# EAGLE schematic argon-v1.00 (EAGLE 9.0.1)

## Sheet 1 of 2
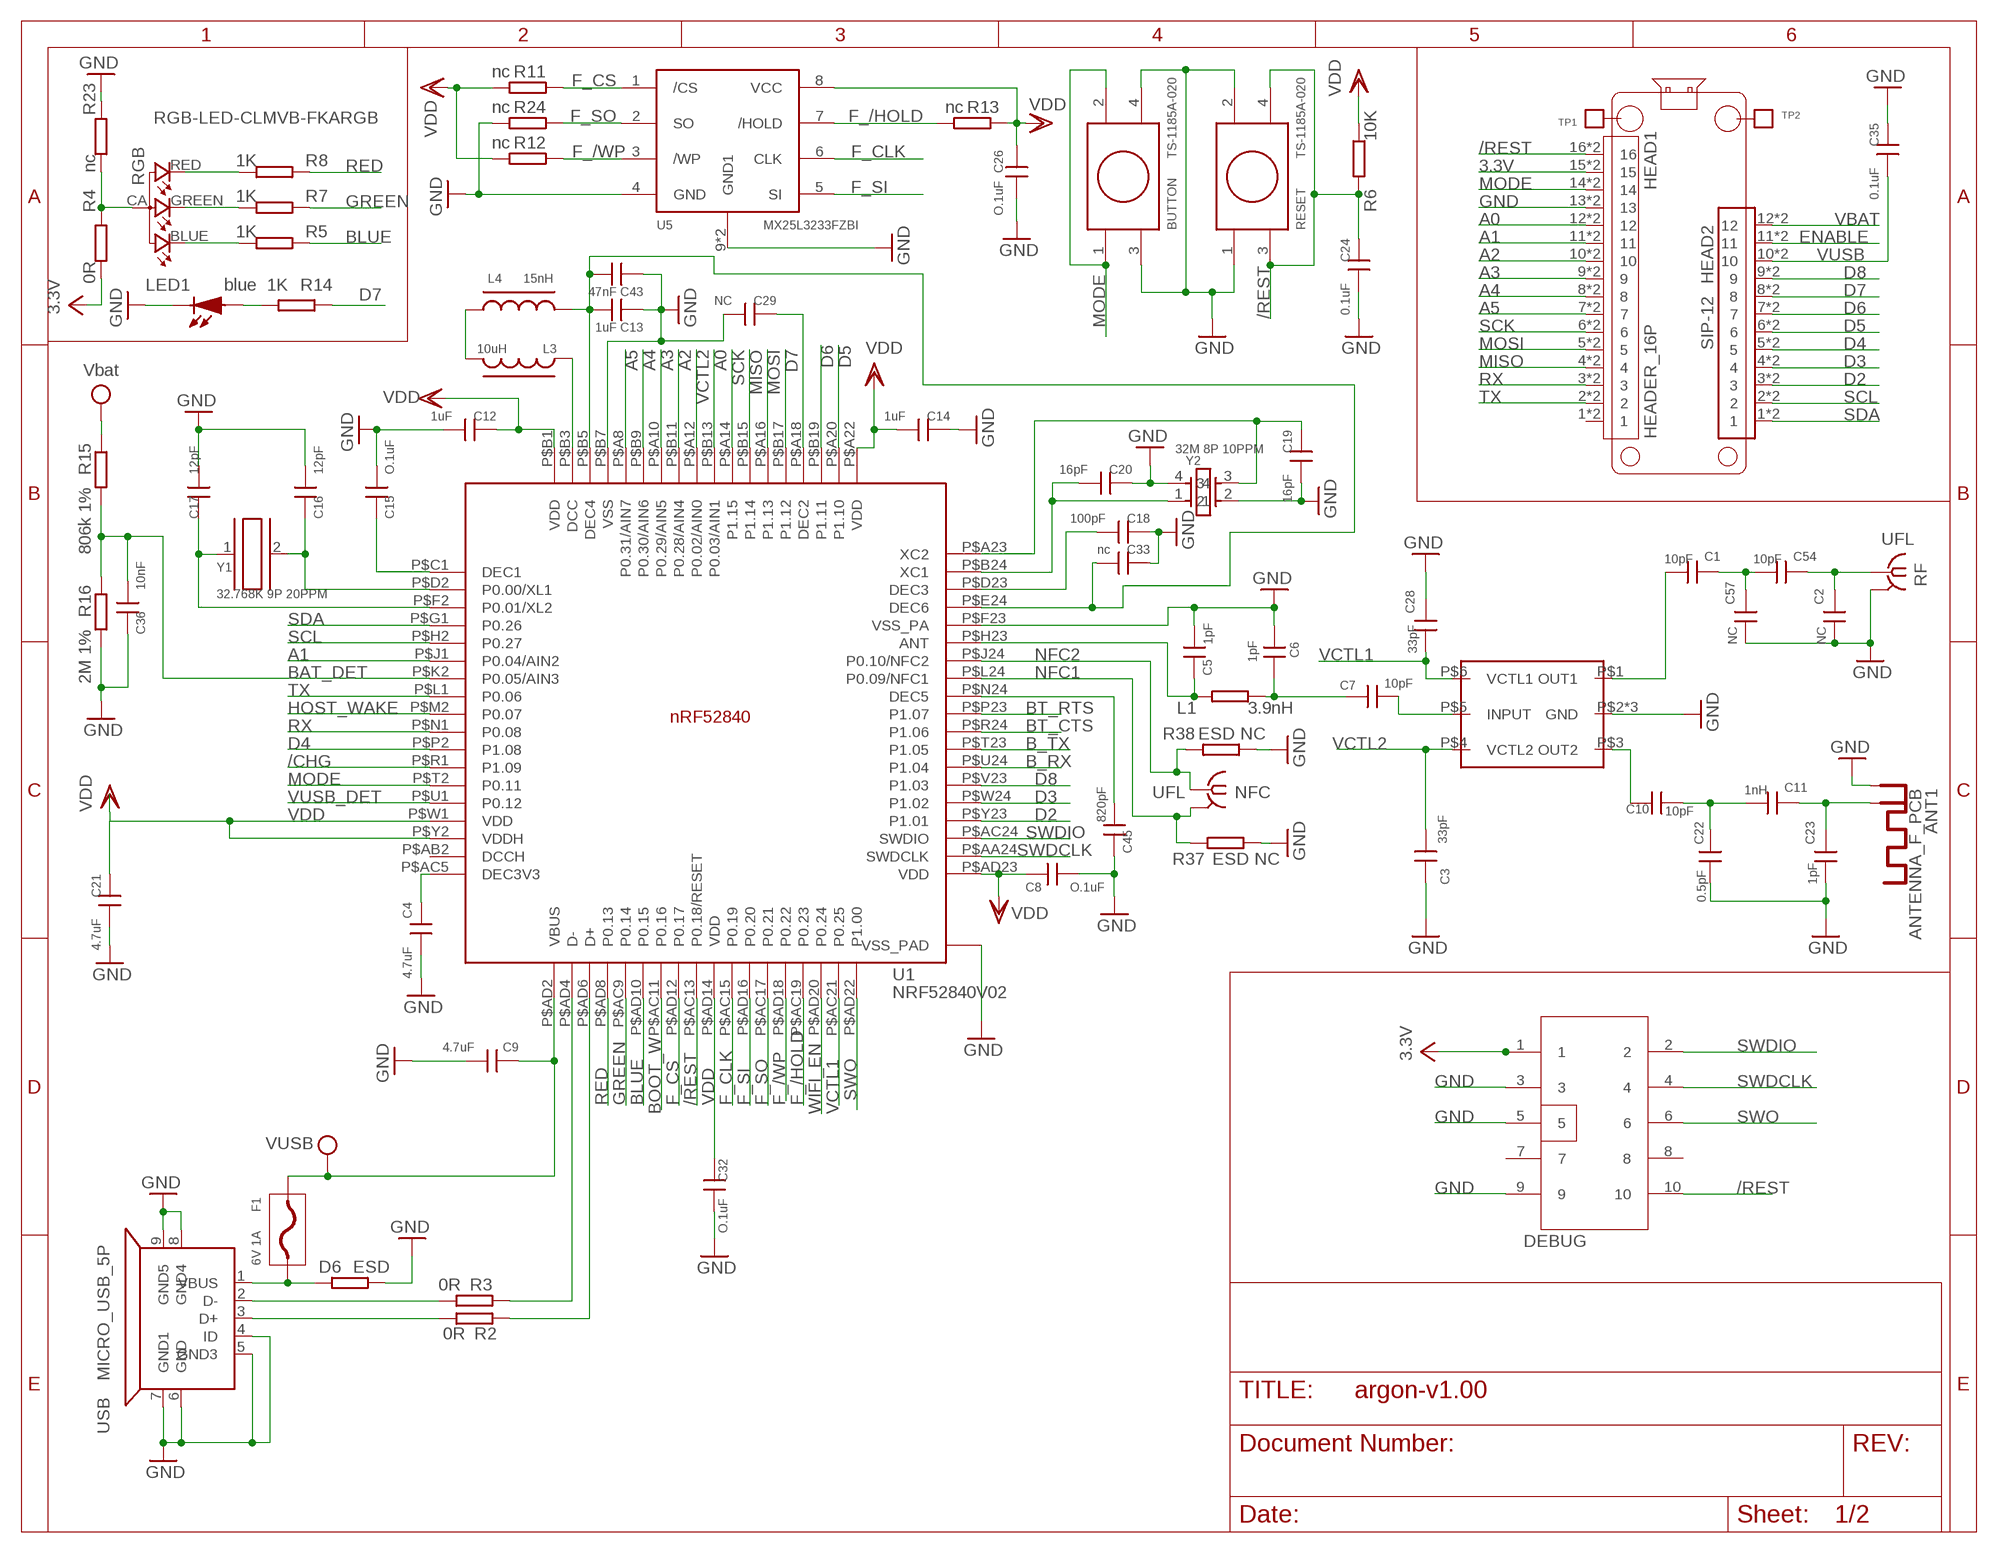
[diagram p0: schematic, sheet 1]

### Parts
ANT1  ANTENNA_F_PCB  [ANTENNA_F_PCB]
BUTTON  TS-1185A-020  [TS-1185A-020]
C1  10pF  CAP0402  [C-0402]
C2  NC  CAP0402  [C-0402]
C3  33pF  CAP0402  [C-0402]
C4  4.7uF  CAP0402  [C-0402]
C5  1pF  CAP0402  [C-0402]
C6  1pF  CAP0402  [C-0402]
C7  10pF  CAP0402  [C-0402]
C8  O.1uF  CAP0402  [C-0402]
C9  4.7uF  CAP0402  [C-0402]
C10  10pF  CAP0402  [C-0402]
C11  1nH  CAP0402  [C-0402]
C12  1uF  CAP0402  [C-0402]
C13  1uF  CAP0402  [C-0402]
C14  1uF  CAP0402  [C-0402]
C15  O.1uF  CAP0402  [C-0402]
C16  12pF  CAP0402  [C-0402]
C17  12pF  CAP0402  [C-0402]
C18  100pF  CAP0402  [C-0402]
C19  16pF  CAP0402  [C-0402]
C20  16pF  CAP0402  [C-0402]
C21  4.7uF  CAP0402  [C-0402]
C22  0.5pF  CAP0402  [C-0402]
C23  1pF  CAP0402  [C-0402]
C24  0.1uF  CAP0402  [C-0402]
C26  O.1uF  CAP0402  [C-0402]
C28  33pF  CAP0402  [C-0402]
C29  NC  CAP0402  [C-0402]
C32  O.1uF  CAP0402  [C-0402]
C33  nc  CAP0402  [C-0402]
C35  0.1uF  CAP0402  [C-0402]
C36  10nF  CAP0402  [C-0402]
C43  47nF  CAP0402  [C-0402]
C45  820pF  CAP0402  [C-0402]
C54  10pF  CAP0402  [C-0402]
C57  NC  CAP0402  [C-0402]
D6  ESD  RES0402S  [R-0402S]
DEBUG  CON5X2  [CON5X2_1.27]
F1  6V 1A  FUSE  [F0805]
HEAD1  HEADER_16P  [HEADER_16P2.54]
HEAD2  SIP-12  [SIP-12]
L1  3.9nH  RES0402S  [R-0402S]
L3  10uH  L  [R-0603A]
L4  15nH  L0402  [R-0402S]
LED1  blue  LED  [LED0603]
NFC  UFL  IPEX-20279-001E  [IPEX-20279-001E]
R2  0R  RES0402S  [R-0402S]
R3  0R  RES0402S  [R-0402S]
R4  0R  RES0402S  [R-0402S]
R5  1K  RES0402S  [R-0402S]
R6  10K  RES0402S  [R-0402S]
R7  1K  RES0402S  [R-0402S]
R8  1K  RES0402S  [R-0402S]
R11  nc  RES0402S  [R-0402S]
R12  nc  RES0402S  [R-0402S]
R13  nc  RES0402S  [R-0402S]
R14  1K  RES0402S  [R-0402S]
R15  806k 1%  RES0402S  [R-0402S]
R16  2M 1%  RES0402S  [R-0402S]
R23  nc  RES0402S  [R-0402S]
R24  nc  RES0402S  [R-0402S]
R37  ESD NC  RES0402S  [R-0402S]
R38  ESD NC  RES0402S  [R-0402S]
RESET  TS-1185A-020  [TS-1185A-020]
RF  UFL  IPEX-20279-001E  [IPEX-20279-001E]
RGB  RGB-LED-CLMVB-FKARGB  [PLCC4-2MM-RGB]
TP1  TPTP2.5  [TP-2.5]
TP2  TPTP2.5  [TP-2.5]
U1  NRF52840V02  [AQN507X7X0.85_HA-74_V2]
U5  MX25L3233FZBI  FLASH-SPIUSON-8L-4X3  [USON8-3X4]
U$2  SKY13351-378LF  [MLPD-6-1X1]
USB  MICRO_USB_5P  MICRO_USBMICRO_USB  [MICRO_USB]
Y1  32.768K 9P 20PPM  CRY_32153215  [CRY_3215]
Y2  32M 8P 10PPM  CRY2520  [CRY_2520]

### Nets
3.3V: DEBUG.1 HEAD1.15 HEAD1.P$15 R4.2 ; also sheet 2
/CHG: U1.P$R1(P1.09) ; also sheet 2
/REST: C24.2 DEBUG.10 HEAD1.16 HEAD1.P$16 R6.1 RESET.3 RESET.4 U1.P$AC13(P0.18/RESET) ; also sheet 2
A0: HEAD1.12 HEAD1.P$12 U1.P$B13(P0.03/AIN1)
A1: HEAD1.11 HEAD1.P$11 U1.P$J1(P0.04/AIN2)
A2: HEAD1.10 HEAD1.P$10 U1.P$B11(P0.28/AIN4)
A3: HEAD1.9 HEAD1.P$9 U1.P$A10(P0.29/AIN5)
A4: HEAD1.8 HEAD1.P$8 U1.P$B9(P0.30/AIN6)
A5: HEAD1.7 HEAD1.P$7 U1.P$A8(P0.31/AIN7)
B_RX: U1.P$U24(P1.04) ; also sheet 2
B_TX: U1.P$T23(P1.05) ; also sheet 2
BAT_DET: C36.1 R15.2 R16.1 U1.P$K2(P0.05/AIN3)
BLUE: R5.1 U1.P$AD10(P0.15)
BOOT_W: U1.P$AC11(P0.16) ; also sheet 2
BT_CTS: U1.P$R24(P1.06) ; also sheet 2
BT_RTS: U1.P$P23(P1.07) ; also sheet 2
D2: HEAD2.3 HEAD2.P$3 U1.P$Y23(P1.01)
D3: HEAD2.4 HEAD2.P$4 U1.P$W24(P1.02)
D4: HEAD2.5 HEAD2.P$5 U1.P$P2(P1.08)
D5: HEAD2.6 HEAD2.P$6 U1.P$A20(P1.10)
D6: HEAD2.7 HEAD2.P$7 U1.P$B19(P1.11)
D7: HEAD2.8 HEAD2.P$8 R14.1 U1.P$B17(P1.12)
D8: HEAD2.9 HEAD2.P$9 U1.P$V23(P1.03)
D+: R2.2 USB.3(D+)
D-: R3.2 USB.2(D-)
ENABLE: HEAD2.11 HEAD2.P$11 ; also sheet 2
F_/HOLD: R13.2 U1.P$AC19(P0.23) U5.7(/HOLD)
F_/WP: R12.1 U1.P$AD18(P0.22) U5.3(/WP)
F_CLK: U1.P$AC15(P0.19) U5.6(CLK)
F_CS: R11.1 U1.P$AD12(P0.17) U5.1(/CS)
F_SI: U1.P$AD16(P0.20) U5.5(SI)
F_SO: R24.1 U1.P$AC17(P0.21) U5.2(SO)
GND: ANT1.GND BUTTON.3 BUTTON.4 C2.2 C3.1 C4.1 C5.1 C6.1 C8.1 C9.1 C12.1 C13.2 C14.2 C15.1 C16.1 C17.1 C18.2 C19.1 C20.2 C21.1 C22.2 C23.2 C24.1 C26.1 C28.1 C29.1 C32.1 C33.2 C35.2 C36.2 C43.2 C45.2 C57.2 D6.1 DEBUG.3 DEBUG.5 DEBUG.9 HEAD1.13 HEAD1.P$13 LED1.2(K) R16.2 R23.1 R24.2 R37.2 R38.1 RESET.1 RESET.2 RF.2@1(GND) RF.2@2(GND) U1.P$74(VSS_PAD) U1.P$75(VSS_PAD) U1.P$76(VSS_PAD) U1.P$77(VSS_PAD) U1.P$78(VSS_PAD) U1.P$79(VSS_PAD) U1.P$80(VSS_PAD) U1.P$81(VSS_PAD) U1.P$82(VSS_PAD) U1.P$85(VSS_PAD) U1.P$B7(VSS) U1.P$F23(VSS_PA) U5.4(GND) U5.9(GND1) U5.10(GND1) U$2.P$2(GND) U$2.P$7(GND) U$2.P$8(GND) USB.4(ID) USB.5(GND3) USB.6(GND) USB.7(GND1) USB.8(GND4) USB.9(GND5) Y2.2 Y2.4 ; also sheet 2
GREEN: R7.1 U1.P$AC9(P0.14)
HOST_WAKE: U1.P$M2(P0.07) ; also sheet 2
MISO: HEAD1.4 HEAD1.P$4 U1.P$B15(P1.14)
MODE: BUTTON.1 BUTTON.2 HEAD1.14 HEAD1.P$14 U1.P$T2(P0.11)
MOSI: HEAD1.5 HEAD1.P$5 U1.P$A16(P1.13)
N$2: C5.2 L1.1 U1.P$H23(ANT)
N$3: C6.2 C7.2 L1.2
N$4: C16.2 U1.P$D2(P0.00/XL1) Y1.2
N$5: C13.1 C33.1 C43.1 L4.2 U1.P$B5(DEC4) U1.P$E24(DEC6)
N$6: L3.2 L4.1
N$7: L3.1 U1.P$B3(DCC)
N$8: C15.2 U1.P$C1(DEC1)
N$9: C17.2 U1.P$F2(P0.01/XL2) Y1.1
N$10: C2.1 C54.1 RF.1
N$11: C19.2 U1.P$A23(XC2) Y2.3
N$12: C18.1 U1.P$D23(DEC3)
N$13: C10.2 C11.2 C22.1
N$15: C20.1 U1.P$B24(XC1) Y2.1
N$16: C7.1 U$2.P$5(INPUT)
N$17: C10.1 U$2.P$3(OUT2)
N$18: D6.2 F1.P$1 USB.1(VBUS)
N$19: LED1.1(A) R14.2
N$23: R8.2 RGB.RED
N$26: R5.2 RGB.BLUE
N$27: R7.2 RGB.GREEN
N$28: C29.2 U1.P$A18(DEC2)
N$29: C4.2 U1.P$AC5(DEC3V3)
N$30: C45.1 U1.P$N24(DEC5)
N$33: C1.2 U$2.P$1(OUT1)
N$42: C1.1 C54.2 C57.1
N$55: R4.1 R23.2 RGB.CA
N$71: R2.1 U1.P$AD6(D+)
N$72: R3.1 U1.P$AD4(D-)
N$74: ANT1.RF C11.1 C23.1
NFC1: NFC.2@1(GND) NFC.2@2(GND) R37.1 U1.P$L24(P0.09/NFC1)
NFC2: NFC.1 R38.2 U1.P$J24(P0.10/NFC2)
RED: R8.1 U1.P$AD8(P0.13)
RX: HEAD1.3 HEAD1.P$3 U1.P$N1(P0.08)
SCK: HEAD1.6 HEAD1.P$6 U1.P$A14(P1.15)
SCL: HEAD2.2 HEAD2.P$2 U1.P$H2(P0.27)
SDA: HEAD2.1 HEAD2.P$1 U1.P$G1(P0.26)
SWDCLK: DEBUG.4 U1.P$AA24(SWDCLK)
SWDIO: DEBUG.2 U1.P$AC24(SWDIO)
SWO: DEBUG.6 U1.P$AD22(P1.00)
TX: HEAD1.2 HEAD1.P$2 U1.P$L1(P0.06)
VBAT: HEAD2.12 HEAD2.P$12 R15.1 ; supply symbol labelled Vbat ; also sheet 2
VCTL1: C28.2 U1.P$AC21(P0.25) U$2.P$6(VCTL1)
VCTL2: C3.2 U1.P$A12(P0.02/AIN0) U$2.P$4(VCTL2)
VDD: C8.2 C12.2 C14.1 C21.2 C26.2 C32.2 R6.2 R11.2 R12.2 R13.1 U1.P$A22(VDD) U1.P$AD14(VDD) U1.P$AD23(VDD) U1.P$B1(VDD) U1.P$W1(VDD) U1.P$Y2(VDDH) U5.8(VCC) ; also sheet 2
VUSB: C9.2 C35.1 F1.P$2 HEAD2.10 HEAD2.P$10 U1.P$AD2(VBUS) ; also sheet 2
VUSB_DET: U1.P$U1(P0.12) ; also sheet 2
WIFI_EN: U1.P$AD20(P0.24) ; also sheet 2
Unconnected: DEBUG.7 DEBUG.8 HEAD1.1 HEAD1.P$1 TP1.1 TP2.1 U1.P$AB2(DCCH)

## Sheet 2 of 2
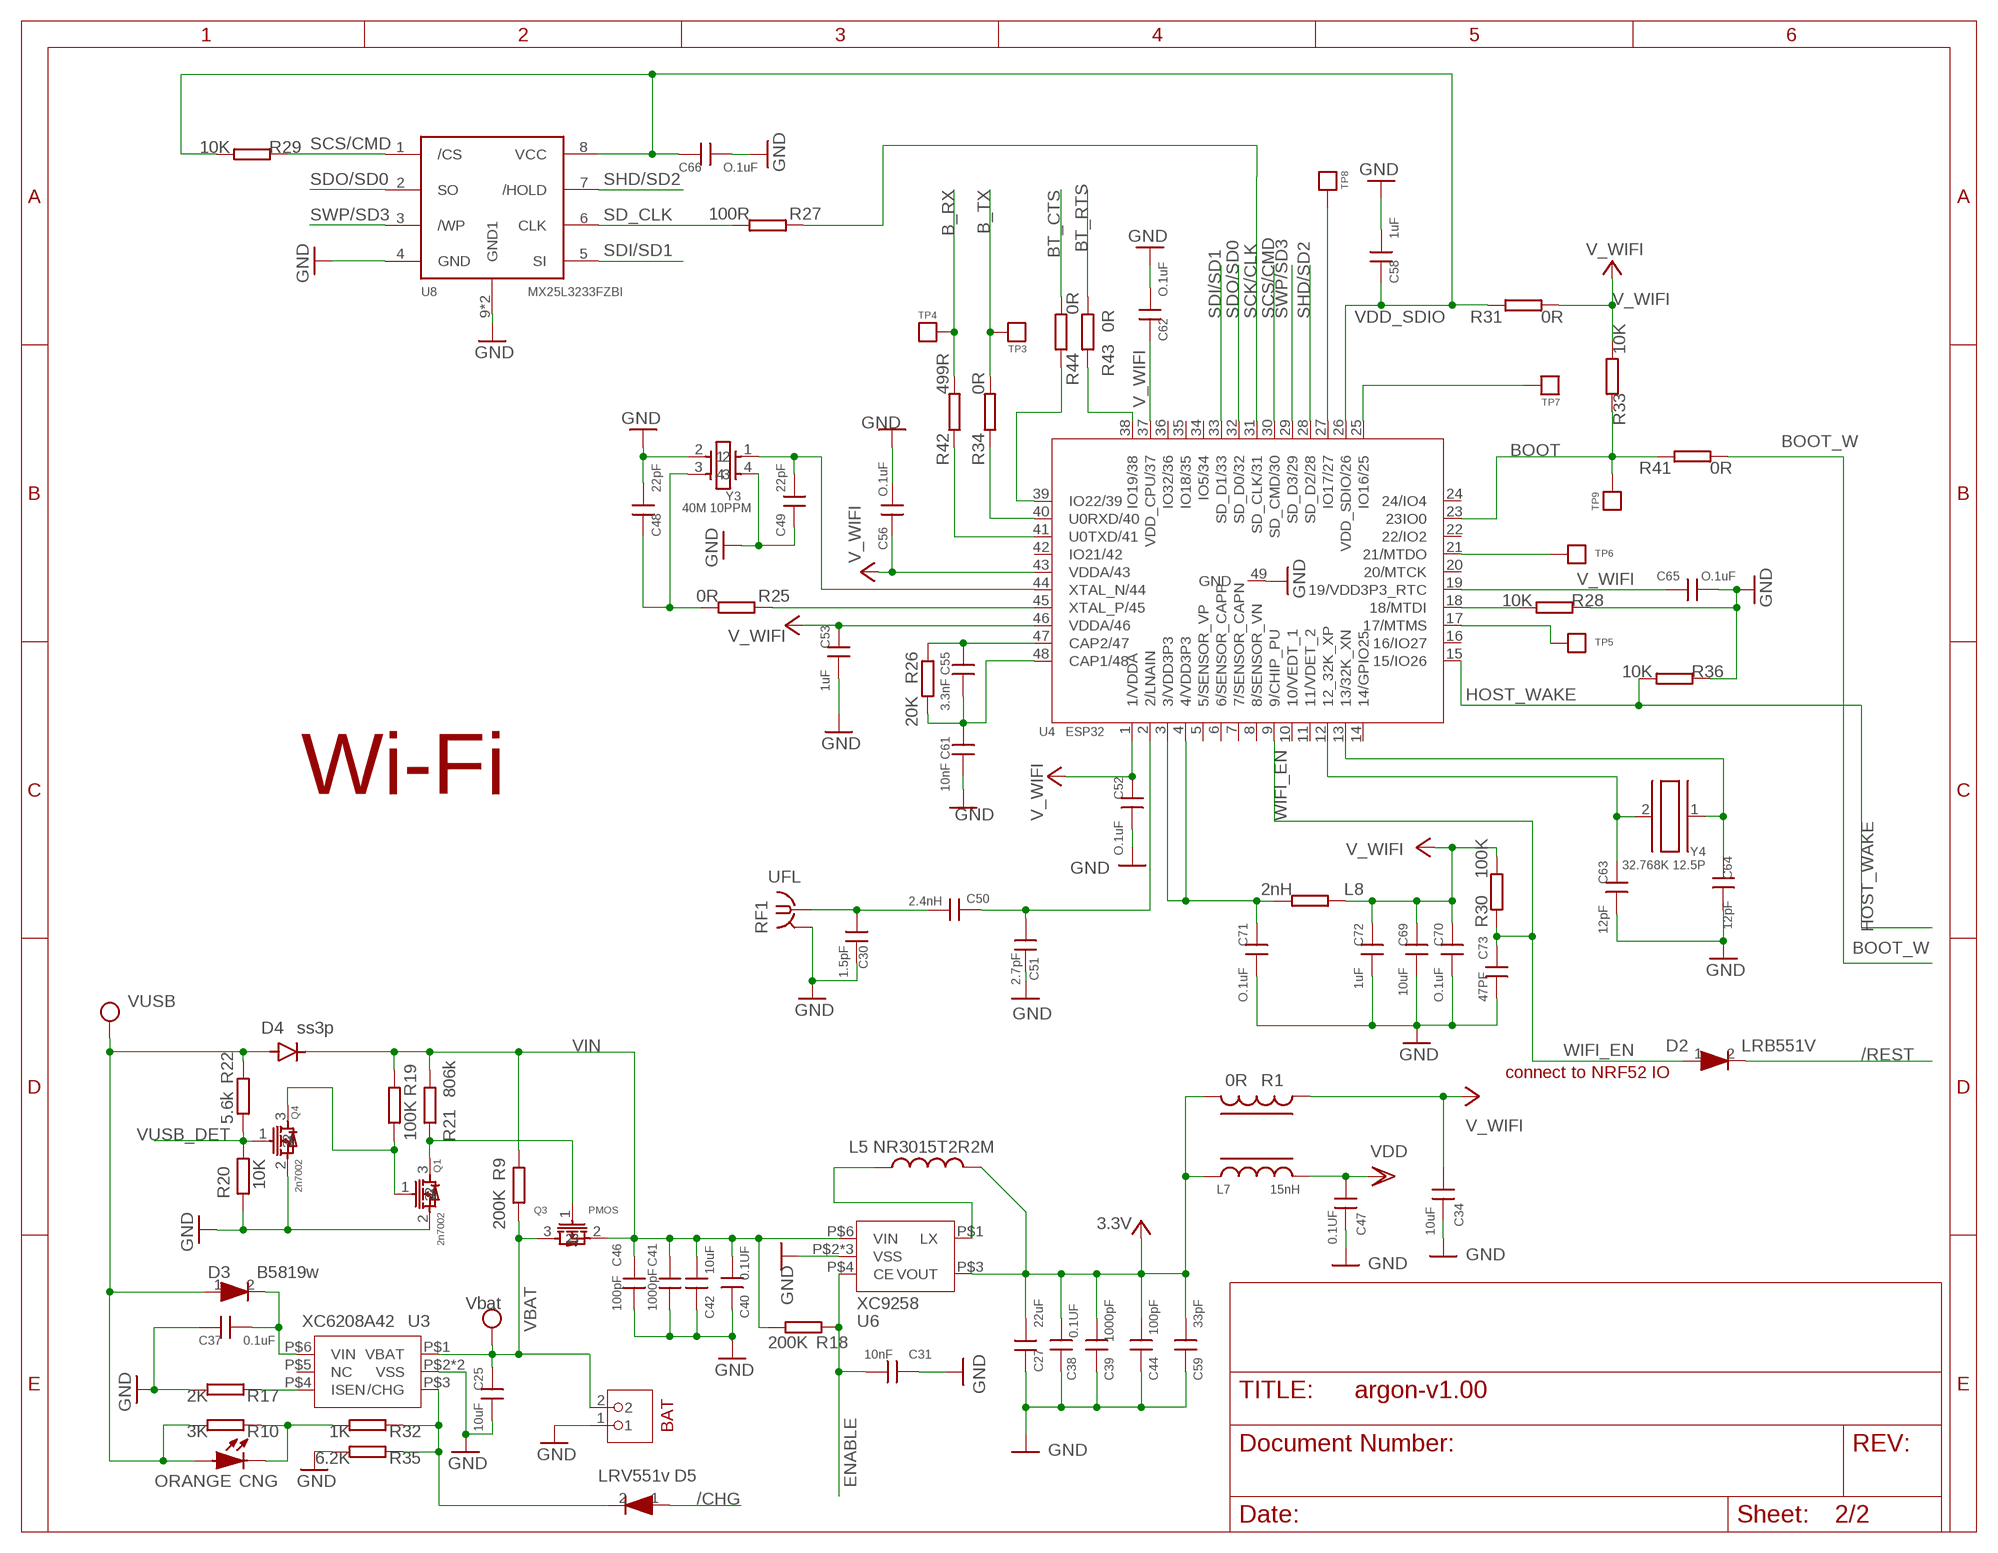
[diagram p1: schematic, sheet 2]

### Parts
BAT  CON2P_SMT  [CON_2.0MM_SMT]
C25  10uF  CAPC0805  [C0805]
C27  22uF  CAPC0805  [C0805]
C30  1.5pF  CAPC0201-N  [C0201-N]
C31  10nF  CAP0402  [C-0402]
C34  10uF  CAPC0603  [C0603]
C37  0.1uF  CAP0402  [C-0402]
C38  0.1UF  CAP0402  [C-0402]
C39  1000pF  CAP0402  [C-0402]
C40  0.1UF  CAP0402  [C-0402]
C41  1000pF  CAP0402  [C-0402]
C42  10uF  CAPC0603  [C0603]
C44  100pF  CAP0402  [C-0402]
C46  100pF  CAP0402  [C-0402]
C47  0.1UF  CAP0402  [C-0402]
C48  22pF  CAPC0201-N  [C0201-N]
C49  22pF  CAPC0201-N  [C0201-N]
C50  2.4nH  CAPC0201-N  [C0201-N]
C51  2.7pF  CAPC0201-N  [C0201-N]
C52  O.1uF  CAP0402  [C-0402]
C53  1uF  CAP0402  [C-0402]
C55  3.3nF  CAPC0201-N  [C0201-N]
C56  O.1uF  CAP0402  [C-0402]
C58  1uF  CAP0402  [C-0402]
C59  33pF  CAP0402  [C-0402]
C61  10nF  CAPC0201-N  [C0201-N]
C62  O.1uF  CAP0402  [C-0402]
C63  12pF  CAP0402  [C-0402]
C64  12pF  CAP0402  [C-0402]
C65  O.1uF  CAP0402  [C-0402]
C66  O.1uF  CAP0402  [C-0402]
C69  10uF  CAPC0805  [C0805]
C70  O.1uF  CAP0402  [C-0402]
C71  O.1uF  CAP0402  [C-0402]
C72  1uF  CAP0402  [C-0402]
C73  47PF  CAP0402  [C-0402]
CNG  ORANGE  LED  [LED0603]
D2  LRB551V  DIODESOD323  [SOD-323]
D3  B5819w  DIODESOD123  [SOD-123]
D4  ss3p  DIODE  [DIODE-DO-220AA(SMP)]
D5  LRV551v  DIODESOD323  [SOD-323]
L5  NR3015T2R2M  INDUCTORB  [INDUCTOR-NR3015]
L7  15nH  L0402  [R-0402S]
L8  2nH  RES0402S  [R-0402S]
Q1  2n7002  NMOSSOT323  [SOT323]
Q3  PMOS  [SOT-23]
Q4  2n7002  NMOSSOT323  [SOT323]
R1  0R  L  [R-0603A]
R9  200K  RES0402S  [R-0402S]
R10  3K  RES0402S  [R-0402S]
R17  2K  RES0402S  [R-0402S]
R18  200K  RES0402S  [R-0402S]
R19  100K  RES0402S  [R-0402S]
R20  10K  RES0402S  [R-0402S]
R21  806k  RES0402S  [R-0402S]
R22  5.6k  RES0402S  [R-0402S]
R25  0R  RESR0201-N  [R0201-N]
R26  20K  RESR0201-N  [R0201-N]
R27  100R  RES0402S  [R-0402S]
R28  10K  RES0402S  [R-0402S]
R29  10K  RES0402S  [R-0402S]
R30  100K  RES0402S  [R-0402S]
R31  0R  RES0402S  [R-0402S]
R32  1K  RES0402S  [R-0402S]
R33  10K  RES0402S  [R-0402S]
R34  0R  RES0402S  [R-0402S]
R35  6.2K  RES0402S  [R-0402S]
R36  10K  RES0402S  [R-0402S]
R41  0R  RES0402S  [R-0402S]
R42  499R  RES0402S  [R-0402S]
R43  0R  RES0402S  [R-0402S]
R44  0R  RES0402S  [R-0402S]
RF1  UFL  IPEX-20279-001E  [IPEX-20279-001E]
TP3  TP  [TP0.7MM]
TP4  TP  [TP0.7MM]
TP5  TP  [TP0.7MM]
TP6  TP  [TP0.7MM]
TP7  TP  [TP0.7MM]
TP8  TP  [TP0.7MM]
TP9  TP  [TP0.7MM]
U3  XC6208A42  [USP-6C]
U4  ESP32  [QFN48-5X5]
U6  XC9258  XC9257/8USP-6  [USP-6C]
U8  MX25L3233FZBI  FLASH-SPIUSON-8L-4X3  [USON8-3X4]
Y3  40M 10PPM  CRY  [CRY_2016]
Y4  32.768K 12.5P  CRY_32153215  [CRY_3215]

### Nets
3.3V: C27.1 C38.2 C39.2 C44.2 C59.2 L5.2 L7.1 R1.2 U6.P$3(VOUT) ; also sheet 1
/CHG: D5.1 ; also sheet 1
/REST: D2.2 ; also sheet 1
B_RX: R42.2 TP4.P$1 ; also sheet 1
B_TX: R34.2 TP3.P$1 ; also sheet 1
BOOT: R33.1 R41.1 TP9.P$1 U4.23(23IO0)
BOOT_W: R41.2 ; also sheet 1
BT_CTS: R44.2 ; also sheet 1
BT_RTS: R43.2 ; also sheet 1
CH: D5.2 R32.1 R35.1 U3.P$3(/CHG)
ENABLE: C31.2 R18.1 U6.P$4(CE) ; also sheet 1
GND: BAT.1 C25.1 C27.2 C30.2 C31.1 C34.2 C37.2 C38.1 C39.1 C40.1 C41.2 C42.2 C44.1 C46.2 C47.2 C48.1 C49.2 C51.1 C52.1 C53.1 C56.1 C58.1 C59.1 C61.1 C62.1 C63.1 C64.1 C65.1 C66.1 C69.1 C70.1 C71.1 C72.1 C73.1 Q1.2 Q4.2 R17.2 R20.1 R28.1 R35.2 R36.1 RF1.2@1(GND) RF1.2@2(GND) U3.P$2(VSS) U3.P$7(VSS) U4.49(GND) U6.P$2(VSS) U6.P$5(VSS) U6.P$7(VSS) U8.4(GND) U8.9(GND1) U8.10(GND1) Y3.2 Y3.4 ; also sheet 1
HOST_WAKE: R36.2 U4.15(15/IO26) ; also sheet 1
N$1: C49.1 U4.44(XTAL_N/44) Y3.1
N$14: Q1.1 Q4.3 R19.1
N$20: R25.1 U4.45(XTAL_P/45)
N$21: Q1.3 Q3.1 R21.2
N$22: TP8.P$1 U4.27(IO17/27)
N$24: C55.2 R26.1 U4.47(CAP2/47)
N$25: R34.1 U4.40(U0RXD/40)
N$31: R17.1 U3.P$4(ISEN)
N$32: C30.1 C50.2 RF1.1
N$34: R42.1 U4.41(U0TXD/41)
N$35: CNG.2(K) R10.1 R32.2
N$36: R44.1 U4.39(IO22/39)
N$38: L5.1 U6.P$1(LX)
N$39: C55.1 C61.2 R26.2 U4.48(CAP1/48)
N$40: C37.1 D3.2 U3.P$6(VIN)
N$41: C71.2 L8.2 U4.3(3/VDD3P3) U4.4(4/VDD3P3)
N$46: TP7.P$1 U4.25(IO16/25)
N$47: R28.2 U4.18(18/MTDI)
N$48: C63.2 U4.12(12_32K_XP) Y4.2
N$49: C64.2 U4.13(13/32K_XN) Y4.1
N$50: C48.2 R25.2 Y3.3
N$51: TP6.P$1 U4.21(21/MTDO)
N$52: C50.1 C51.2 U4.2(2/LNAIN)
N$53: TP5.P$1 U4.17(17/MTMS)
N$54: R43.1 U4.38(IO19/38)
SCK/CLK: R27.1 U4.31(SD_CLK/31)
SCS/CMD: R29.1 U4.30(SD_CMD/30) U8.1(/CS)
SD_CLK: R27.2 U8.6(CLK)
SDI/SD1: U4.33(SD_D1/33) U8.5(SI)
SDO/SD0: U4.32(SD_D0/32) U8.2(SO)
SHD/SD2: U4.28(SD_D2/28) U8.7(/HOLD)
SWP/SD3: U4.29(SD_D3/29) U8.3(/WP)
V_WIFI: C34.1 C52.2 C53.2 C56.2 C62.2 C65.2 C69.2 C70.2 C72.2 L8.1 R1.1 R30.2 R31.2 R33.2 U4.1(1/VDDA) U4.19(19/VDD3P3_RTC) U4.37(VDD_CPU/37) U4.43(VDDA/43) U4.46(VDDA/46)
VBAT: BAT.2 C25.2 Q3.3 R9.1 U3.P$1(VBAT) ; supply symbol labelled Vbat ; also sheet 1
VDD: C47.1 L7.2 ; also sheet 1
VDD_SDIO: C58.2 C66.2 R29.2 R31.1 U4.26(VDD_SDIO/26) U8.8(VCC)
VIN: C40.2 C41.1 C42.1 C46.1 D4.CATHODE Q3.2 R9.2 R18.2 R19.2 R21.1 U6.P$6(VIN)
VUSB: CNG.1(A) D3.1 D4.ANODE R10.2 R22.1 ; also sheet 1
VUSB_DET: Q4.1 R20.2 R22.2 ; also sheet 1
WIFI_EN: C73.2 D2.1 R30.1 U4.9(9/CHIP_PU) ; also sheet 1
Unconnected: U3.P$5(NC) U4.5(5/SENSOR_VP) U4.6(6/SENSOR_CAPP) U4.7(7/SENSOR_CAPN) U4.8(8/SENSOR_VN) U4.10(10/VEDT_1) U4.11(11/VDET_2) U4.14(14/GPIO25) U4.16(16/IO27) U4.20(20/MTCK) U4.22(22/IO2) U4.24(24/IO4) U4.34(IO5/34) U4.35(IO18/35) U4.36(IO32/36) U4.42(IO21/42)

### Notes on the sheet
- Wi-Fi
- connect to NRF52 IO
- BAT

## Library data of the parts
ANT1 = Particle:ANTENNA_F_PCB: F Style 2.4GHz PCB Trace Antenna
BAT = RedBear:CON2P_SMT
BUTTON RESET = RedBear DUO:TS-1185A-020
C1-C29 C31-C33 C35-C47 C52-C54 C56-C59 C62-C66 C69-C73 = RedBear:CAP: CAP
C30 C34 C48-C51 C55 C61 = particle SZ:CAP: CAP
CNG LED1 = particle SZ:LED: LED
D2 D3 D5 = particle SZ:DIODE: DIODE
D4 = Particle:DIODE
D6 L1 L8 R2-R24 R27-R38 R41-R44 = RedBear:RES: RES
DEBUG = RedBear:CON5X2
F1 = RedBear:FUSE
HEAD1 = particle SZ:HEADER_16P
HEAD2 = particle SZ:SIP-12
L3 L4 L7 = RedBear:L
L5 = Spark:INDUCTOR
NFC RF RF1 = Particle:IPEX-20279-001E: Ultra Miniature Coaxial SMT RF Receptacle
Q1 = RedBear:NMOS: NMOS
Q3 = RedBear:PMOS: PMOS
Q4 = particle SZ:NMOS: NMOS
R1 = particle SZ:L
R25 R26 = particle SZ:RES: RES
RGB = Particle:RGB-LED-CLMVB-FKA: CREE CLMVB-FKA RGB LED 2mm x 2mm
TP1 TP2 = RedBear:TP
TP3-TP9 = particle SZ:TP
U1 = particle SZ:NRF52840
U3 = particle SZ:XC6208A42
U4 = particle SZ:ESP32
U5 U8 = particle SZ:FLASH-SPI
U6 = particle SZ:XC9257/8
U$2 = particle SZ:SKY13351-378LF
USB = RedBear:MICRO_USB: Micro-USB
Y1 Y4 = RedBear:CRY_3215
Y2 = RedBear DUO:CRY
Y3 = particle SZ:CRY